# EAGLE schematic schematic (EAGLE 7.7.0)
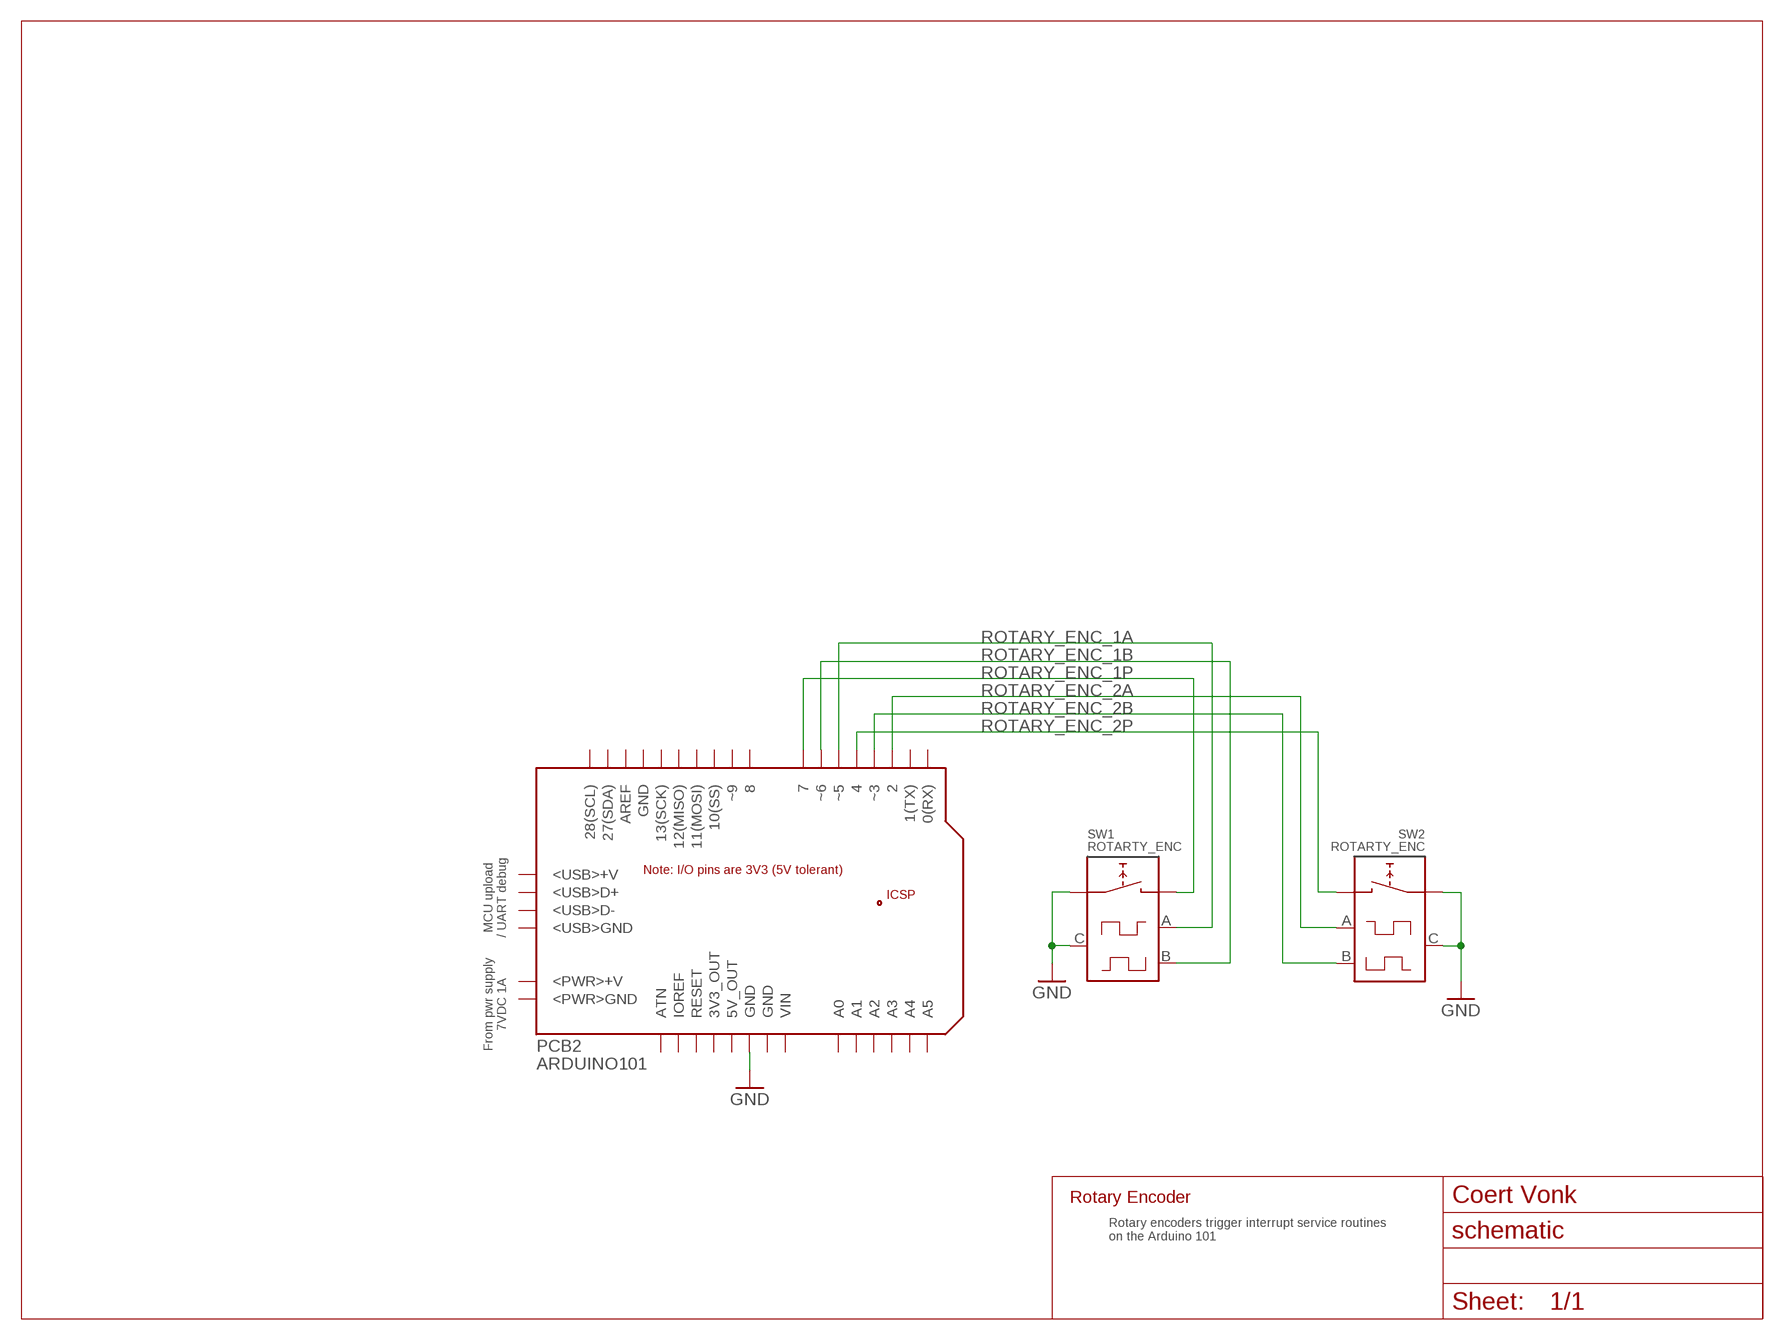
[diagram p0: schematic, sheet 1]
U$1 (FRAME_LETTER_L): AUTHOR_NAME: Coert Vonk; DESCRIPTION: Rotary Encoder; REV: 1.0; URL: http://www.coertvonk.com

## Parts
PCB2  ARDUINO101  [ARDUINO101]
SW1  ROTARTY_ENC  [ROTARY_ENC]
SW2  ROTARTY_ENC  [ROTARY_ENC]

## Nets
GND: PCB2.GND..(GND) SW1.C SW1.SW- SW2.C SW2.SW-
ROTARY_ENC_1A: PCB2.5(~5) SW1.A
ROTARY_ENC_1B: PCB2.6(~6) SW1.B
ROTARY_ENC_1P: PCB2.7 SW1.SW+
ROTARY_ENC_2A: PCB2.2 SW2.A
ROTARY_ENC_2B: PCB2.3(~3) SW2.B
ROTARY_ENC_2P: PCB2.4 SW2.SW+
Unconnected: PCB2.0(0(RX)) PCB2.1(1(TX)) PCB2.8 PCB2.9(~9) PCB2.10(10(SS)) PCB2.11(11(MOSI)) PCB2.12(12(MISO)) PCB2.13(13(SCK)) PCB2.+5V PCB2.<PWR>+V PCB2.<PWR>-V(<PWR>GND) PCB2.<USB>D+ PCB2.<USB>D- PCB2.A0 PCB2.A1 PCB2.A2 PCB2.A3 PCB2.A4 PCB2.A5 PCB2.AREF PCB2.ATN PCB2.GND_ PCB2.I/OREF(IOREF) PCB2.MISO PCB2.MOSI PCB2.RESET PCB2.RESET. PCB2.SCK PCB2.SCL(28(SCL)) PCB2.SDA(27(SDA)) PCB2.VIN

## Notes on the sheet
- MCU upload
  / UART debug
- From pwr supply
  7VDC 1A
- Rotary encoders trigger interrupt service routines
  on the Arduino 101

## Power pins joined to a net without a drawn wire
3V3_OUT: PCB2.3.3V(3V3_OUT)
5V_OUT: PCB2.5V(5V_OUT)
<USB>+V: PCB2.<USB>+V
<USB>GND: PCB2.<USB>GND
GND: PCB2.GND PCB2.GND.(GND)

## Library data of the parts
PCB2 = Coert Vonk:ARDUINO101: Schematic symbol for representing an Arduino/Genuino 101 board in an EAGLE schematic. Created by Dave Young for Element14. More 101 documentation at: https://www.element14.com/community/docs/DOC-80459/l/intel-genuino-101-development-board More EAGLE documentation at: http://www.element14.com/community/community/knode/cadsoft_eagle
SW1 SW2 = Coert Vonk:ROTARTY_ENC: Simple no LED rotary encoder Example: COM-09117